# EAGLE design max4999 (EAGLE 9.6.2)
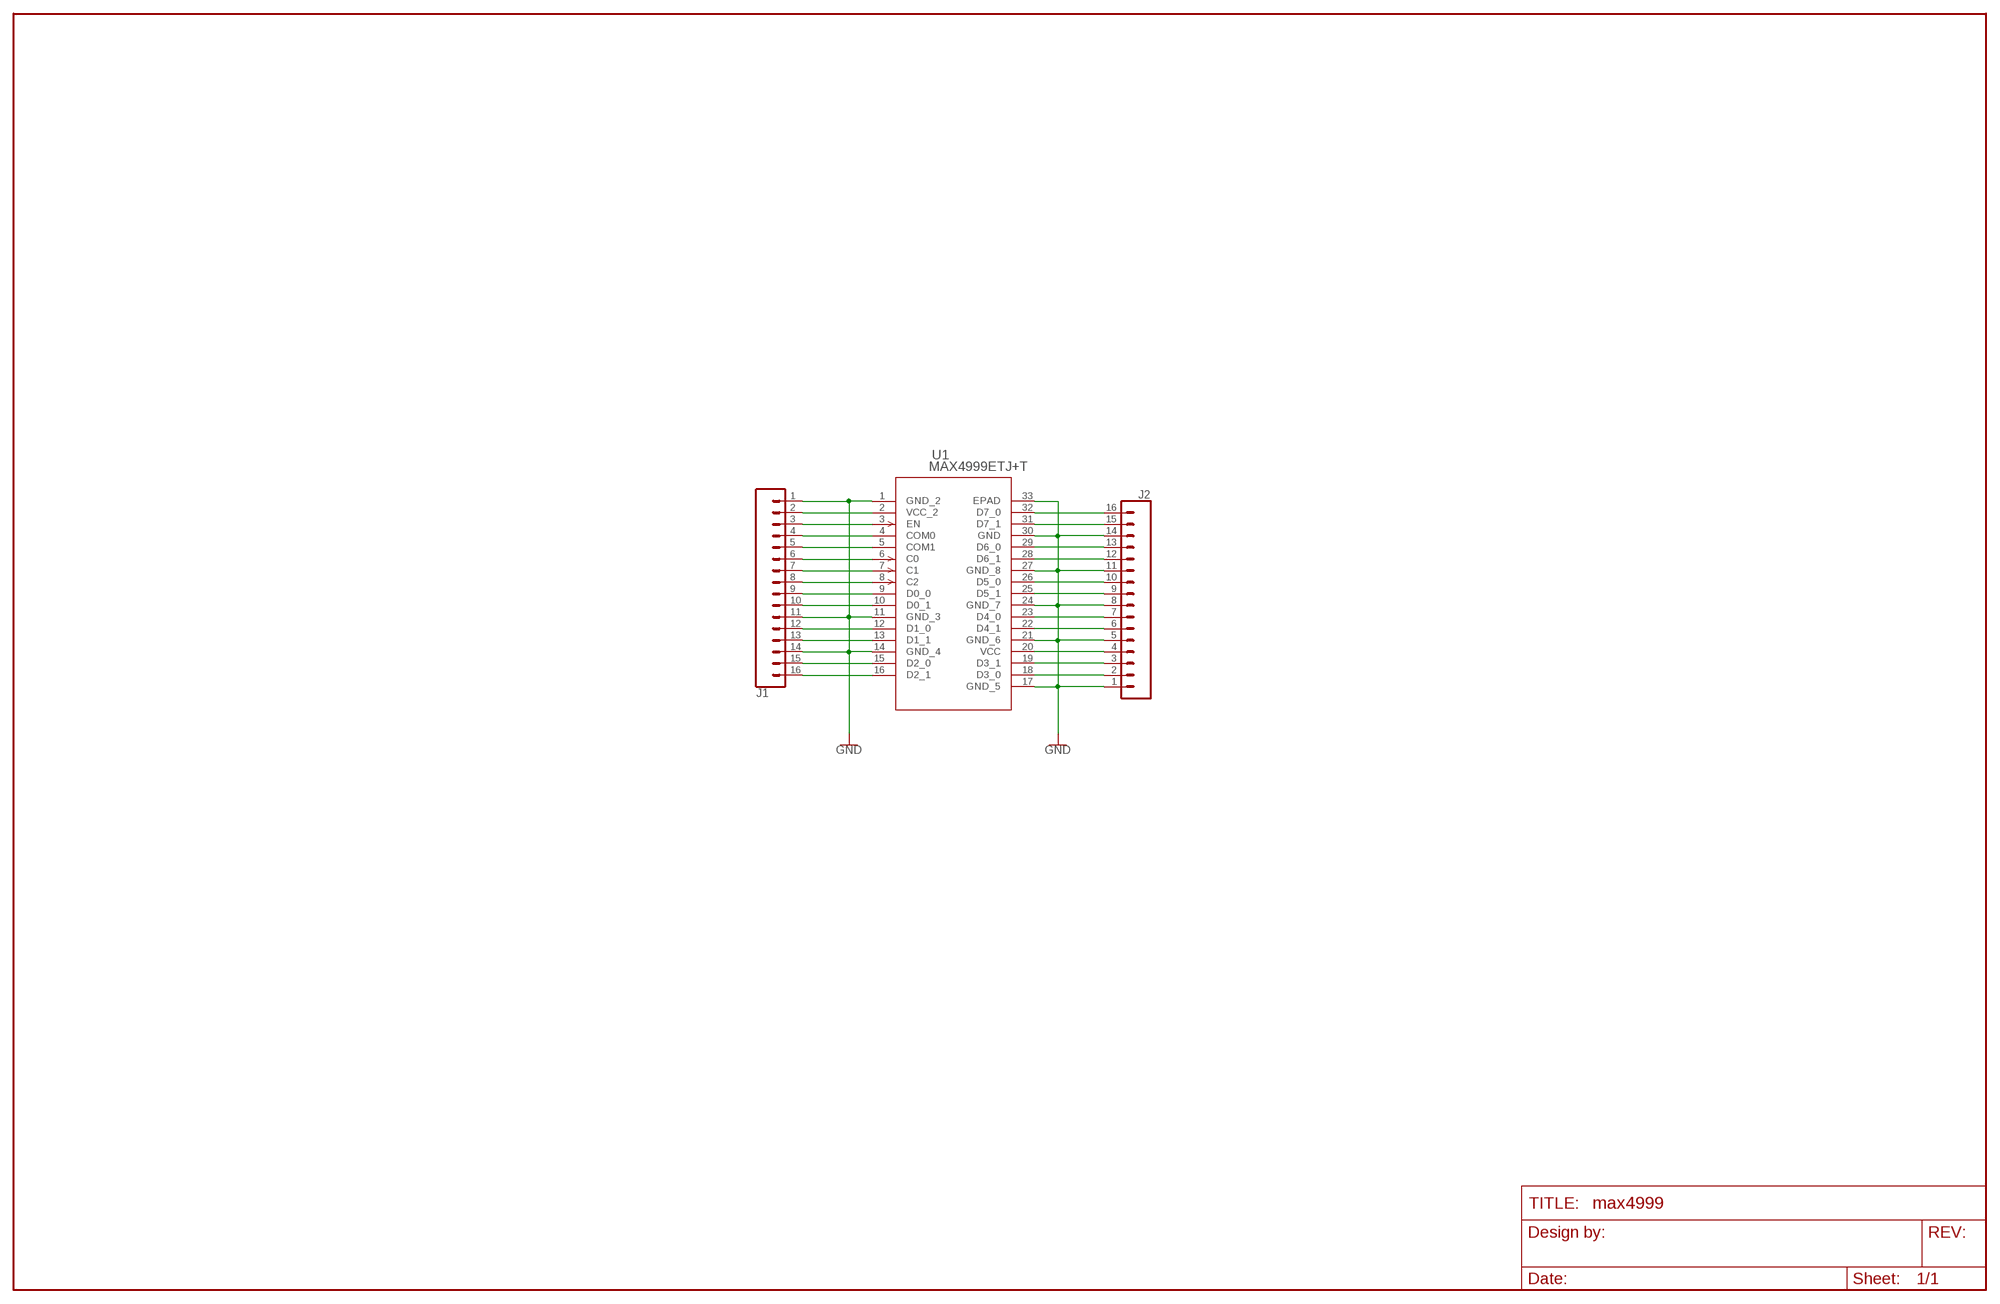
[diagram p0: schematic, sheet 1]

## Parts
FRAME1  FRAME-LEDGERNO_FOOTPRINT  [DUMMY]
J1  CONN_161X16_NO_SILK  [1X16_NO_SILK]
J2  CONN_161X16_NO_SILK  [1X16_NO_SILK]
U1  MAX4999ETJ+T  [21-0140_T3255+4_MXM]

## Nets
GND: J1.1 J1.11 J1.14 J2.1 J2.5 J2.8 J2.11 J2.14 U1.1(GND_2) U1.11(GND_3) U1.14(GND_4) U1.17(GND_5) U1.21(GND_6) U1.24(GND_7) U1.27(GND_8) U1.30(GND) U1.33(EPAD)
N$1: J1.2 U1.2(VCC_2)
N$2: J1.3 U1.3(EN)
N$3: J1.4 U1.4(COM0)
N$4: J1.5 U1.5(COM1)
N$5: J1.6 U1.6(C0)
N$6: J1.7 U1.7(C1)
N$7: J1.8 U1.8(C2)
N$8: J1.9 U1.9(D0_0)
N$9: J1.10 U1.10(D0_1)
N$10: J1.12 U1.12(D1_0)
N$11: J1.13 U1.13(D1_1)
N$12: J1.15 U1.15(D2_0)
N$13: J1.16 U1.16(D2_1)
N$14: J2.16 U1.32(D7_0)
N$15: J2.15 U1.31(D7_1)
N$16: J2.13 U1.29(D6_0)
N$17: J2.12 U1.28(D6_1)
N$18: J2.10 U1.26(D5_0)
N$19: J2.9 U1.25(D5_1)
N$20: J2.7 U1.23(D4_0)
N$21: J2.6 U1.22(D4_1)
N$22: J2.4 U1.20(VCC)
N$23: J2.3 U1.19(D3_1)
N$24: J2.2 U1.18(D3_0)

## Library data of the parts
FRAME1 = SparkFun-Aesthetics:FRAME-LEDGER: Schematic Frame - Ledger Standard 11x14 US Ledger frame
J1 J2 = SparkFun-Connectors:CONN_16: Multi connection point. Often used as Generic Header-pin footprint for 0.1 inch spaced/style header connections On any of the 0.1 inch spaced packages, you can populate with these: Break Away Headers - Straight <https://www.sparkfun.com/products/116> (PRT-00116) Break Away Male Headers - Right Angle <https://www.sparkfun.com/products/553> (PRT-00553) Female Headers <https://www.sparkfun.com/products/115> (PRT-00115) Break Away Headers - Machine Pin <https://www.sparkfun.com/products/117> (PRT-00117) Break Away Female Headers - Swiss Machine Pin <https://www.sparkfun.com/products/743> (PRT-00743) For SCREWTERMINALS and SPRING TERMINALS visit here: Screw Terimnals on SparkFun.com <https://www.sparkfun.com/search/results?term=Screw+Terminals> (5mm/3.5mm/2.54mm spacing) This device is also useful as a general connection point to wire up your design to another part of your project. Our various solder wires solder well into these plated through hole pads. Hook-Up Wire - Assortment (Stranded, 22 AWG) <https://www.sparkfun.com/products/11375> (PRT-11375) Hook-Up Wire - Assortment (Solid Core, 22 AWG) <https://www.sparkfun.com/products/11367> (PRT-11367) View the entire wire category on our website here <https://www.sparkfun.com/categories/141> Special notes: Molex polarized connector foot print use with SKU : PRT-08231 with associated crimp pins and housings. 1MM SMD Version SKU: PRT-10208 NOTES ON THE VARIANTS LOCK and LOCK_LONGPADS... This footprint was designed to help hold the alignment of a through-hole component (i.e. 6-pin header) while soldering it into place. You may notice that each hole has been shifted either up or down by 0.005 of an inch from it's more standard position (which is a perfectly straight line). This slight alteration caused the pins (the squares in the middle) to touch the edges of the holes. Because they are alternating, it causes a "brace" to hold the component in place. 0.005 has proven to be the perfect amount of "off-center" position when using our standard breakaway headers. Although looks a little odd when you look at the bare footprint, once you have a header in there, the alteration is very hard to notice. Also,if you push a header all the way into place, it is covered up entirely on the bottom side.
U1 = maxim:MAX4999ETJ+T; COPYRIGHT: Copyright (C) 2022 Ultra Librarian. All rights reserved.; DIGI-KEY_PART_NUMBER_1: MAX4999ETJ+T-ND; DIGI-KEY_PART_NUMBER_2: MAX4999ETJ+TCT-ND; DIGI-KEY_PART_NUMBER_3: MAX4999ETJ+TDKR-ND; DIGI-KEY_PART_NUMBER_4: MAX4999ETJ+TTR-ND; MANUFACTURER_PART_NUMBER: MAX4999ETJ+T; MFR_NAME: Maxim Integrated Products

## Board
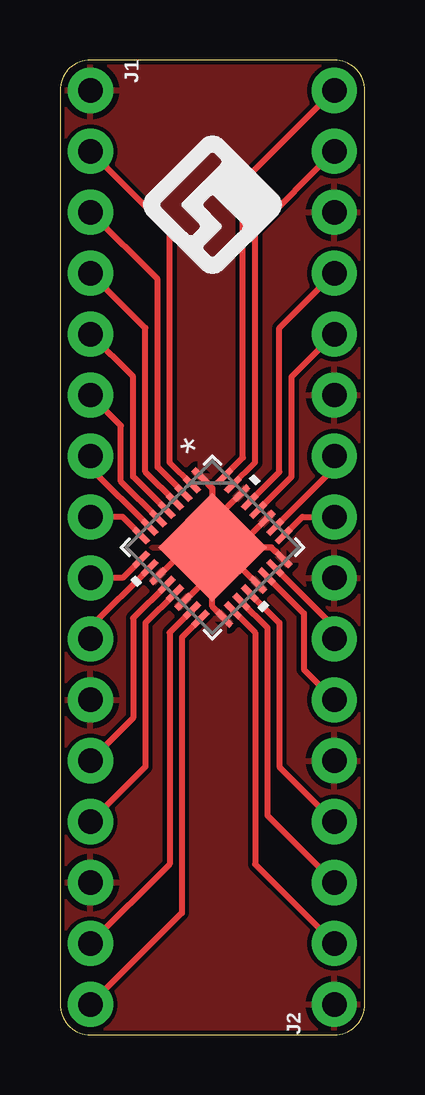
[diagram p1: board, top side]
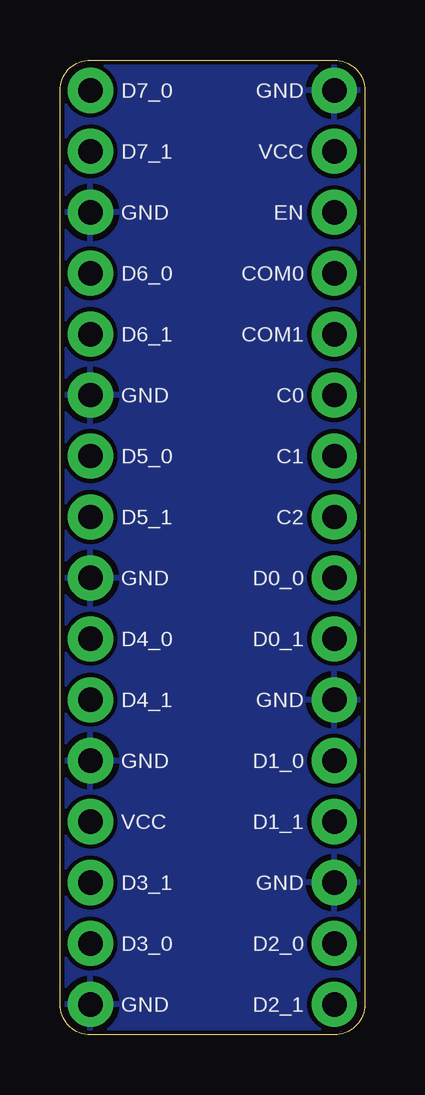
[diagram p2: board, bottom side, seen from below]

Size 12.7 x 40.64 mm. Coordinates in mm from the lower left corner, seen from the top.
Outline: 0,39.37 0,1.27 arc90 1.27,0 11.43,0 arc90 12.7,1.27 12.7,39.37 arc90 11.43,40.64 1.27,40.64 arc90 0,39.37
Copper layers (1*16): Top 0.035mm / dielectric 1.5mm / Bottom 0.035mm
Design rules "SparkFun-2-Layer-General-JLCPCB": minimum track width 7mil, minimum drill 0.3mm, track to track 7mil, track to pad 7mil, pad to pad 7mil, via to via 7mil, smd to smd 7mil, copper to edge 7mil, drill to drill 7mil, minimum pad ring 7mil, minimum via ring 7mil, stop-mask expansion 3mil, vias tented up to drill 25mil, thermal gap 10mil

### Footprints (pad centres in the part's own frame; a part is rotated, then mirrored left to right if it is on the bottom)
1X16_NO_SILK = drill 1.016 pad 1.88: 1 0,0; 2 2.54,0; 3 5.08,0; 4 7.62,0; 5 10.16,0; 6 12.7,0; 7 15.24,0; 8 17.78,0; 9 20.32,0; 10 22.86,0; 11 25.4,0; 12 27.94,0; 13 30.48,0; 14 33.02,0; 15 35.56,0; 16 38.1,0
21-0140_T3255+4_MXM = smd 0.813 x 0.254: 1 -2.451,1.75; 2 -2.451,1.25; 3 -2.451,0.75; 4 -2.451,0.25; 5 -2.451,-0.25; 6 -2.451,-0.75; 7 -2.451,-1.25; 8 -2.451,-1.75; 17 2.451,-1.75; 18 2.451,-1.25; 19 2.451,-0.75; 20 2.451,-0.25; 21 2.451,0.25; 22 2.451,0.75; 23 2.451,1.25; 24 2.451,1.75 | smd 0.254 x 0.813: 9 -1.75,-2.451; 10 -1.25,-2.451; 11 -0.75,-2.451; 12 -0.25,-2.451; 13 0.25,-2.451; 14 0.75,-2.451; 15 1.25,-2.451; 16 1.75,-2.451; 25 1.75,2.451; 26 1.25,2.451; 27 0.75,2.451; 28 0.25,2.451; 29 -0.25,2.451; 30 -0.75,2.451; 31 -1.25,2.451; 32 -1.75,2.451 | smd 3.2 x 3.2: 33 0,0

### Placement (x,y rotation side)
FRAME1  0,0 0 top
J1  1.27,39.37 270 top
J2  11.43,1.27 90 top
U1  6.35,20.32 315 top

### Tracks (layer width: path | path; a pad name or v marks a point on that pad's centre or on a via)
GND
  Top 0.254: U1.11 5.29,20.32 U1.33 | U1.14 6.35,19.26 U1.33 | U1.1 6.16,22.98 6.16,22.97 6.35,22.78 U1.33 | U1.30 6.35,21.38 U1.33 | U1.27 7.41,20.32 U1.33 | U1.24 9.01,20.13 9,20.13 8.81,20.32 U1.33 | U1.21 6.7,20.32 U1.33 | U1.17 6.54,17.66 6.54,17.67 6.35,17.86 U1.33
  pour Top: 11.43,0 1.27,0 arc-90 0,1.27 0,39.37 arc-90 1.27,40.64 11.43,40.64 arc-90 12.7,39.37 12.7,1.27 arc-90
  pour Bottom: 11.43,0 1.27,0 arc-90 0,1.27 0,39.37 arc-90 1.27,40.64 11.43,40.64 arc-90 12.7,39.37 12.7,1.27 arc-90
N$1
  Top 0.254: U1.2 4.57,23.87 4.57,33.53 J1.2
N$2
  Top 0.254: U1.3 4.06,23.67 4.06,31.5 J1.3
N$3
  Top 0.254: U1.4 3.56,23.47 3.56,29.46 J1.4
N$4
  Top 0.254: U1.5 3.05,23.27 3.05,27.43 J1.5
N$5
  Top 0.254: U1.6 2.54,23.07 2.54,25.4 J1.6
N$6
  Top 0.254: U1.7 1.27,23.63 J1.7
N$7
  Top 0.254: U1.8 2.6,21.59 J1.8
N$8
  Top 0.254: U1.9 2.6,19.05 J1.9
N$9
  Top 0.254: U1.10 1.27,17.01 J1.10
N$10
  Top 0.254: U1.12 3.05,17.37 3.05,13.21 J1.12
N$11
  Top 0.254: U1.13 3.56,17.17 3.56,11.18 J1.13
N$12
  Top 0.254: U1.15 4.57,16.77 4.57,7.11 J1.15
N$13
  Top 0.254: U1.16 5.08,16.57 5.08,5.08 J1.16
N$14
  Top 0.254: U1.32 7.62,24.07 7.62,35.56 J2.16
N$15
  Top 0.254: U1.31 8.13,23.87 8.13,33.53 J2.15
N$16
  Top 0.254: U1.29 9.14,23.47 9.14,29.46 J2.13
N$17
  Top 0.254: U1.28 9.65,23.27 9.65,27.43 J2.12
N$18
  Top 0.254: U1.26 11.43,23.63 J2.10
N$19
  Top 0.254: U1.25 10.1,21.59 J2.9
N$20
  Top 0.254: U1.23 11.43,17.01 J2.7
N$21
  Top 0.254: U1.22 10.16,17.57 10.16,15.24 J2.6
N$22
  Top 0.254: U1.20 9.14,17.17 9.14,11.18 J2.4
N$23
  Top 0.254: U1.19 8.64,16.97 8.64,9.14 J2.3
N$24
  Top 0.254: U1.18 8.13,16.77 8.13,7.11 J2.2

### Text on the board
bPlace: GND | D7_0 | VCC | D7_1 | EN | GND | COM0 | D6_0 | COM1 | D6_1 | C0 | GND | C1 | D5_0 | C2 | D5_1 | D0_0 | GND | D0_1 | D4_0 | GND | D4_1 | D1_0 | GND | D1_1 | VCC | GND | D3_1 | D2_0 | D3_0 | D2_1 | GND